# Altium schematic sheet BOC_CLK_ADJ.SchDoc: Board-On-Chip System Clock
size A; Organization: Altium Limited; Address1: L3, 12a Rodborough Rd; Address2: Frenchs Forest; Address3: NSW; Address4: Australia 2086; Revision: 1.06; SheetNumber: 5; SheetTotal: 16
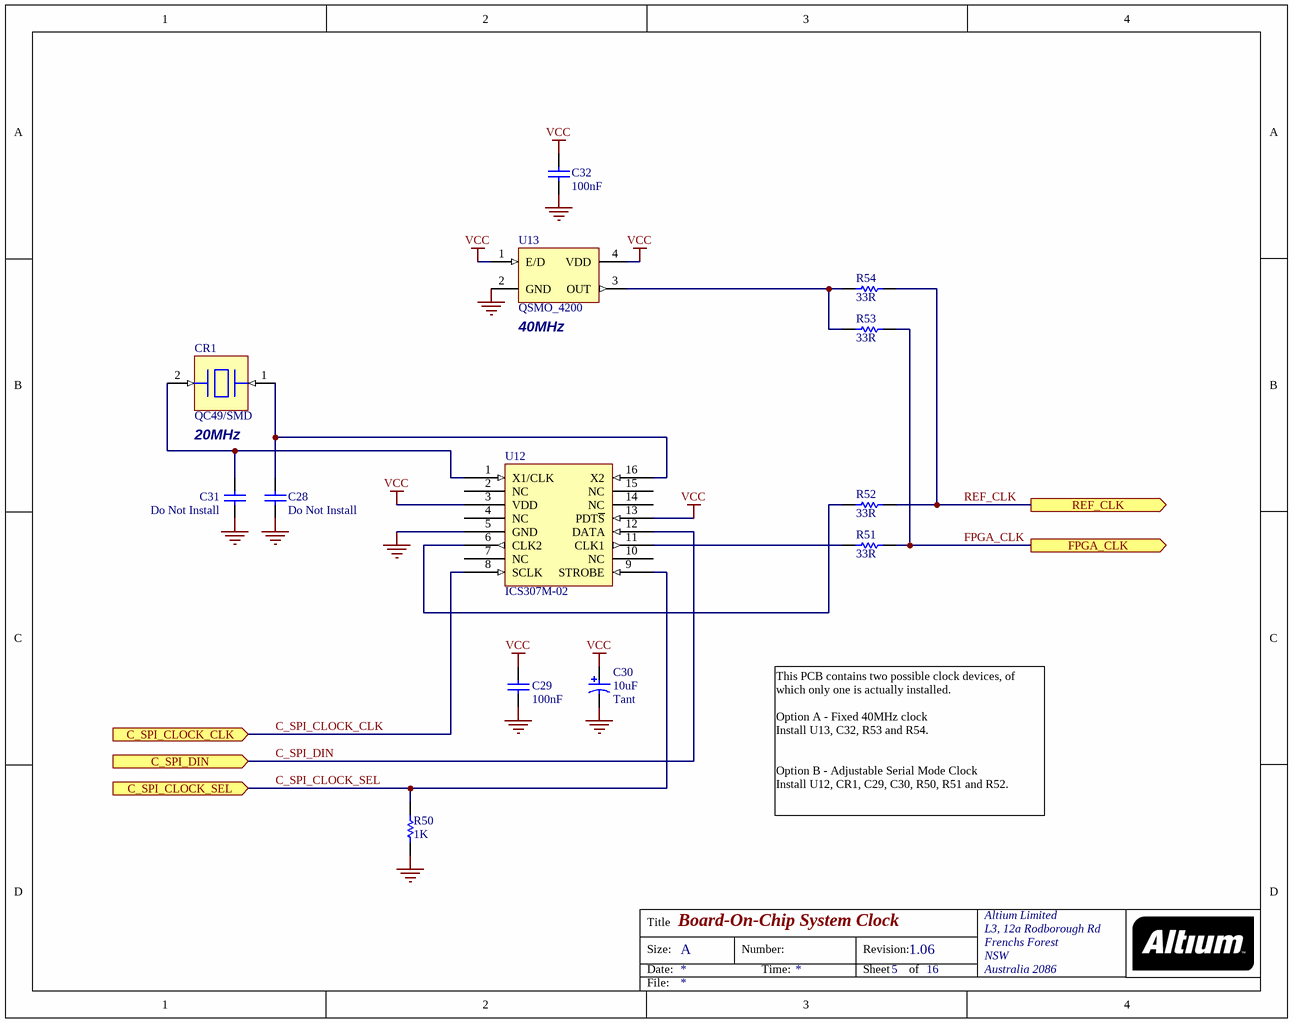
[diagram p0: BOC_CLK_ADJ.SchDoc]

## Parts
C28  Do Not Install  [CC2012-0805]
C29  100nF  [CC2012-0805]
C30  10uF  Capacitor Type: Tant  [MCCT-B]
C31  Do Not Install  [CC2012-0805]
C32  100nF  [CC2012-0805]
CR1  QC49/SMD  [QC49/SMD]
R50  1K  [CC2012-0805]
R51  33R  [CC2012-0805]
R52  33R  [CC2012-0805]
R53  33R  [CC2012-0805]
R54  33R  [CC2012-0805]
U12  ICS307M-02  [SO-G16]
U13  QSMO_4200  [QSMO_4200]

## Ports
C_SPI_CLOCK_CLK (in), C_SPI_CLOCK_SEL (in), C_SPI_DIN (in), FPGA_CLK (out), REF_CLK (out)

## Nets
GND: C28.2 C29.2 C30.2 C31.2 C32.2 R50.2 U12.5(GND) U13.2(GND)
VCC: C29.1 C30.1 C32.1 U12.3(VDD) U12.13(PDT~{S}) U13.1(E/D) U13.4(VDD)
C_SPI_CLOCK_CLK: U12.8(SCLK) ; port C_SPI_CLOCK_CLK
C_SPI_CLOCK_SEL: R50.1 U12.9(STROBE) ; port C_SPI_CLOCK_SEL
C_SPI_DIN: U12.12(DATA) ; port C_SPI_DIN
FPGA_CLK: R51.2 R53.2 ; port FPGA_CLK
REF_CLK: R52.2 R54.2 ; port REF_CLK
NetC28_1: C28.1 CR1.1 U12.16(X2)
NetC31_1: C31.1 CR1.2 U12.1(X1/CLK)
NetR51_1: R51.1 U12.11(CLK1)
NetR52_1: R52.1 U12.6(CLK2)
NetR53_1: R53.1 R54.1 U13.3(OUT)

Not connected (* = marked no-connect by the designer): U12 2(NC) 4(NC) 7(NC) 10(NC) 14(NC) 15(NC)

## Notes on the sheet
- (near U13) 40MHz
- 20MHz
- This PCB contains two possible clock devices, of which only one is actually installed.
  Option A - Fixed 40MHz clock
  Install U13, C32, R53 and R54.
  Option B - Adjustable Serial Mode Clock
  Install U12, CR1, C29, C30, R50, R51 and R52.
- Title
- Size:
- Date:
- A
- Number:
- Time:
- Revision:
- Sheet
- of
- File:

## Library data of the parts
C28 C31 C32 = CAP: Capacitor; Fitted: False
C29 = CAP: Capacitor; Fitted: True
C30 = CAP_POLAR: Polar Capacitor; Fitted: True
CR1 = QC49/SMD: SMD Crystal 20MHz HY-Q; Fitted: True; C-MAC Watch Crystal: *; Farnel/RS-316-0312: *; 4.13$: *; C-MAC/FOX: *; Future: *
R50-R52 = RES: Resistor; Fitted: True
R53 R54 = RES: Resistor; Fitted: False
U12 = ICS307-02: Serial Programmable PLL Oscillator; Fitted: True
U13 = QSMO_4200: Surface Mount Crystal Oscillator; Fitted: False